# EasyEDA Pro project EPS32-v2.epro, board PCB2
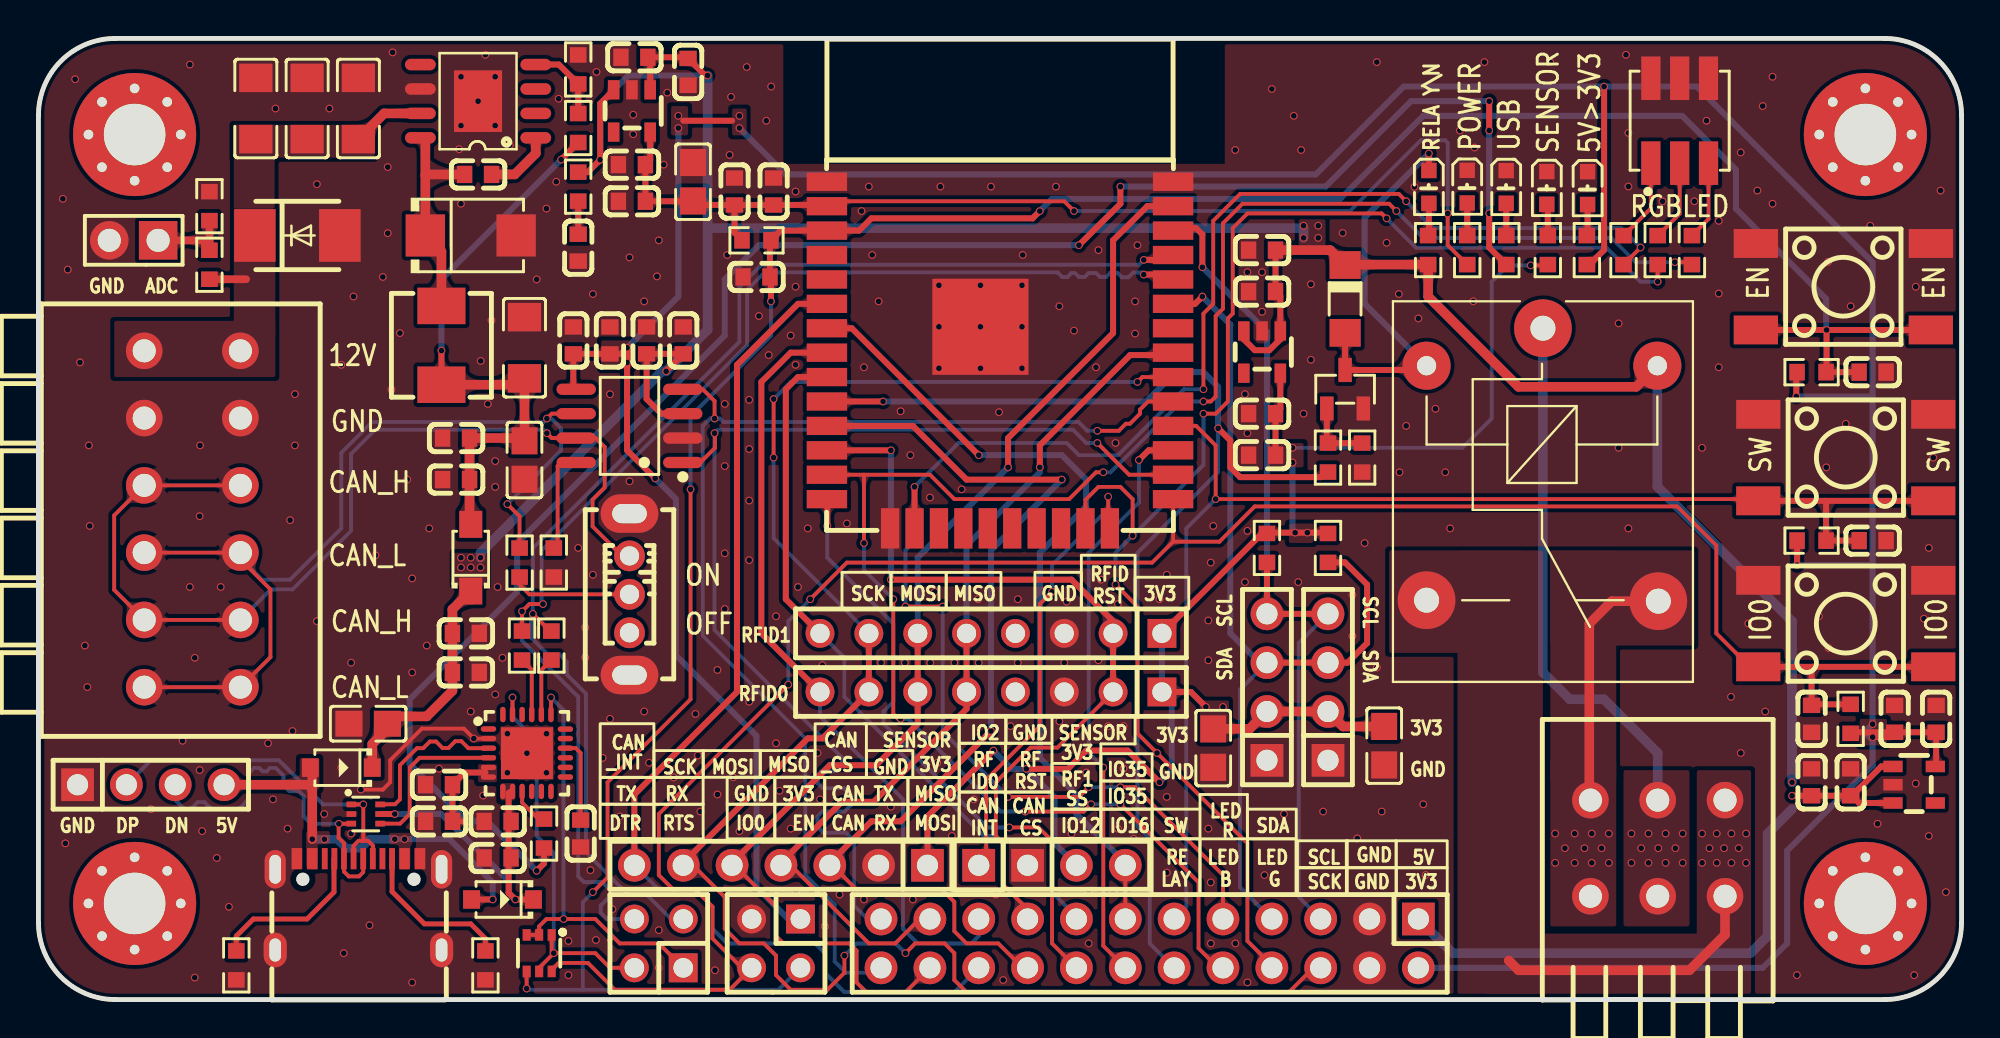
[diagram p1: board, top side]
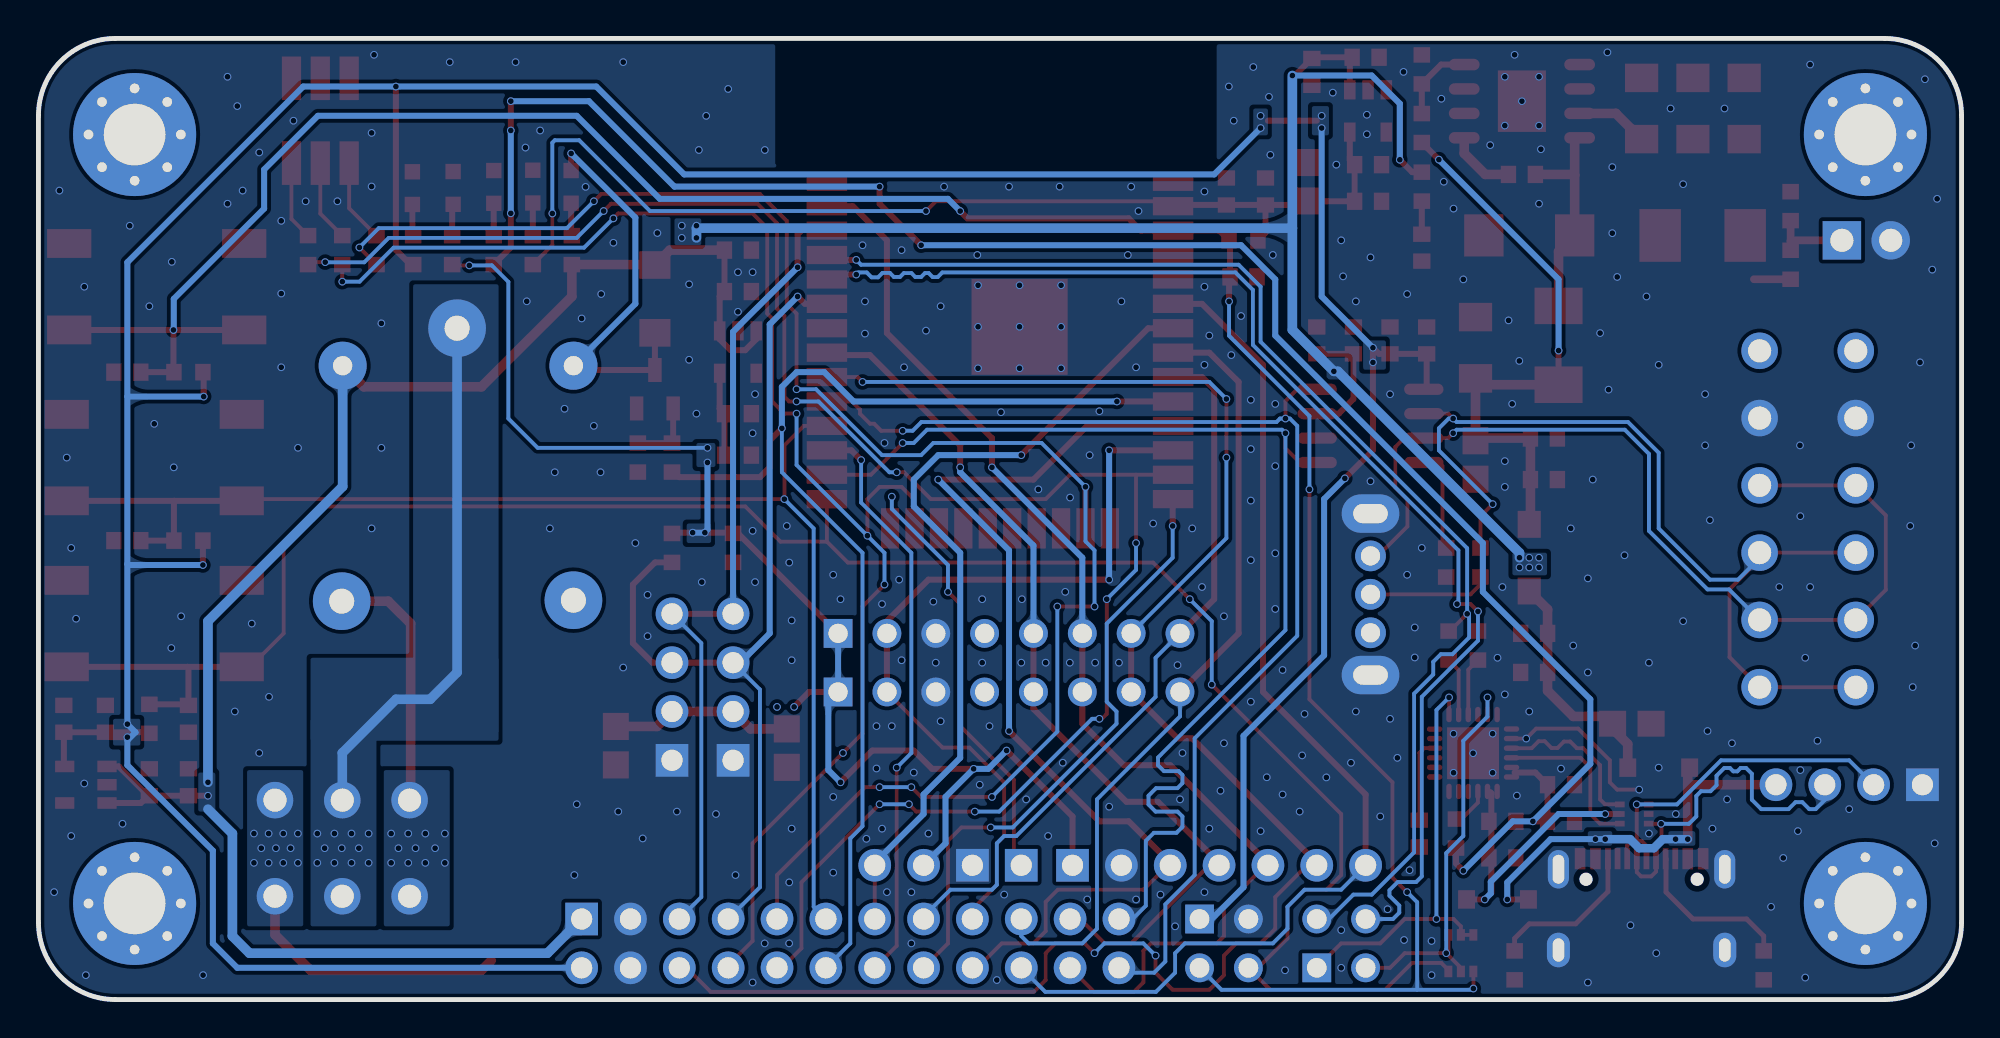
[diagram p2: board, bottom side, seen from below]

Outline 100 x 50 mm; copper layers: Top Layer, Bottom Layer. Coordinates in mm from the lower left corner of the outline.
Outline path: 0,46 0,4 arc(1.17,1.17) 4,0 96,0 arc(98.83,1.17) 100,4 100,46 arc(98.83,48.83) 96,50 4,50 arc(1.17,48.83) 0,46
Stack: Top Layer 0.035mm / Dielectric1 1.51mm FR4 er 4.5 / Bottom Layer 0.035mm

## Design rules (mm)
net $1N1005: DP2
net $1N1016: DP2
net CAN_RX: DP6
net CAN_TX: DP6
net RX: DP4
net TX: DP4
net CAN_H: DP5
net $1N8799: DP3
net $1N8801: DP3
net CAN_L: DP5
net DP: DP7
net DN: DP7
template: 自定义配置1
spacing copperThickness1oz (default): track to track 0.1, other pairs 0.1 to 0.3
spacing copperThickness2oz: track to track 0.203, other pairs 0.152 to 0.3
spacing copperThicknessInner0.5oz: track to track 0.089, other pairs 0.152 to 0.3
track width copperThickness1oz (default): min 0.1, default 0.2, max 10
track width copperThickness0.5oz: min 0.089, default 0.254, max 2.54
track width copperThickness2oz: min 0.203, default 0.254, max 2.54
differential pair differentialPair (default): width min 0.127, default 0.254, max 2.54; gap min 0.2, default 0.2
via viaSize (default): diameter min 0.4, default 0.4, max 10; hole min 0.3, default 0.3, max 6.3

## Placement (name value [footprint] x y rotation side)
C1  22uF  [C0805]  17.14 14.35 180 top
C2  10uF  [C0603]  22.22 17.02 0 top
C3  100nF  [C0603]  22.22 19.05 0 top
C6  4.7uF  [C0603]  28.19 8.64 90 top
C9  100nF  [C0603]  95.38 23.88 0 top
C10  100nF  [C0603]  95.38 32.64 0 top
C11  100nF  [C0603]  92.2 14.61 270 top
C351  10uF  [C0603]  92.2 11.3 270 top
C352  10uF  [C0603]  98.68 14.61 270 top
C353  100nF  [C0603]  94.23 11.3 270 top
C354  100nF  [C0603]  96.52 14.61 270 top
C355  10uF  [C0603]  33.53 34.29 270 top
C356  100nF  [C0603]  31.62 34.29 270 top
C357  10uF  [C0603]  29.72 34.29 270 top
C358  100nF  [C0603]  27.81 34.29 270 top
C359  100nF  [C0603]  20.83 9.27 0 top
C360  4.7uF  [C0603]  20.83 11.18 0 top
C361  10uF  [C0603]  23.88 7.37 0 top
C362  100nF  [C0603]  23.88 9.27 0 top
C363  22uF  [C0805]  69.98 13.21 270 top
C364  22uF  [C0805]  61.09 13.08 270 top
C369  10uF  [C0603]  63.63 38.99 0 top
C370  10uF  [C0603]  63.63 30.48 0 top
C371  100nF  [C0603]  63.63 36.83 0 top
C372  100nF  [C0603]  63.63 28.32 0 top
C373  10uF  [C0603]  30.86 43.43 0 top
C374  100nF  [C0603]  30.99 49.02 0 top
C375  100nF  [C0603]  30.86 41.53 0 top
C376  10uF  [C0603]  33.78 48.26 90 top
C377  22uF  [C0805]  34.04 42.55 90 top
C378  10uF  [C0603]  36.19 42.04 90 top
C379  100nF  [C0603]  38.23 42.04 90 top
C380  100nF  [C0603]  37.34 37.59 180 top
C382  10uF  [C1206]  13.97 46.36 270 top
C383  22uF  [C1206]  11.3 46.36 270 top
C384  100nF  [C1206]  16.64 46.36 270 top
C385  47uF  [C1206]  25.27 33.91 270 top
C386  22uF  [C0805]  25.27 28.07 90 top
C387  10uF  [C0603]  21.72 29.21 0 top
C388  100nF  [C0603]  21.72 27.05 0 top
C389  100nF  [C0603]  22.86 42.93 0 top
C390  4.7uF  [C0603]  28.07 39.12 90 top
CN1  New_Library_2601-1106  [CONN-TH_2601-1106]  8 25 270 top
D1  USBLC6-2P6  [SOT-666-6_L1.6-W1.2-P0.50-LS1.6-BL]  17.02 9.65 270 top
D2  5819W  [SOD-123_L2.7-W1.6-LS3.7-FD]  15.75 12.06 0 top
D3  LL4148-GS08  [SOD-80_L3.5-W1.5-RD]  67.94 36.45 270 top
D5  SS54SMB  [SMB_L4.6-W3.6-LS5.3-RD]  22.48 39.75 0 top
D6  SMBJ28A  [SMB_L4.6-W3.6-LS5.3-L-FD]  13.46 39.75 180 top
D7  DSK34  [SOD-123FL_L2.7-W1.8-LS3.8-RD]  22.48 22.99 90 top
D8  5819W  [SOD-123_L2.7-W1.6-LS3.7-FD]  24.13 5.21 0 top
H1  Hole_Pad  [MountingHole:MountingHole_3.2mm_M3_Pad_Via]  5 5 0 top
H2  Hole_Pad  [MountingHole:MountingHole_3.2mm_M3_Pad_Via]  5 45 0 top
H3  Hole_Pad  [MountingHole:MountingHole_3.2mm_M3_Pad_Via]  95 45 0 top
H4  Hole_Pad  [MountingHole:MountingHole_3.2mm_M3_Pad_Via]  95 5 0 top
H6  PZ254V-11-04P  [HDR-TH_4P-P2.54-V-M]  67.06 16.26 90 top
H7  PZ254V-11-04P  [HDR-TH_4P-P2.54-V-M]  63.88 16.26 90 top
H8  PZ254V-11-03P  [HDR-TH_3P-P2.54-V-M]  53.97 6.98 0 top
H9  PZ254V-11-08P  [HDR-TH_8P-P2.54-V-M]  49.53 16 180 top
H10  PZ254V-11-08P  [HDR-TH_8P-P2.54-V-M]  49.53 19.05 180 top
H11  HX PZ2.54-1x7P ZZ  [HDR-TH_7P-P2.54-V-M]  38.61 6.98 180 top
H12  HX PZ2.54-2x2P ZZ  [HDR-TH_HX-PZ2.54-2X2P-ZZ]  38.35 2.92 180 top
H13  HX PZ2.54-2x2P ZZ  [HDR-TH_HX-PZ2.54-2X2P-ZZ]  32.26 2.92 90 top
H14  PZ254V-12-24P  [HDR-TH_24P-P2.54-V-M-R2-C12-S2.54]  57.78 2.92 180 top
H15  PZ254V-11-01P  [HDR-TH_1P-P2.54-V-M]  48.9 6.98 0 top
H16  PZ254V-11-04P  [HDR-TH_4P-P2.54-V-M]  5.84 11.18 0 top
H17  PZ254V-11-02P  [HDR-TH_2P-P2.54-V-M]  4.95 39.5 180 top
K1  SANYOU_SRD_Form_C  [Relay_THT:Relay_SPDT_SANYOU_SRD_Series_Form_C]  78.23 34.92 270 top
L12  10uH  [IND-SMD_L5.4-W5.2_FXL0530]  20.95 34.04 270 top
LED1  TC5050RGBF08-3CJH-AF53A  [LED-SMD_6P-L5.0-W5.0-TL_TC5050RGBF08]  85.34 45.72 90 top
LED白  NCD0603W1  [LED0603-RD]  76.33 42.16 270 top
LED红  SZYY0603R  [LED0603-R-RD]  74.29 42.29 270 top
LED绿  XL-1608PGC-06  [LED0603-RD_GREEN]  78.49 42.16 270 top
LED蓝  SZYY0603B  [LED0603-R-RD_BLUE]  80.52 42.16 270 top
Q1  UMH3N  [SC-70-6_L2.2-W1.3-P0.65-LS2.1-BR]  26.03 2.41 90 top
Q2  BC817  [SOT-23-3_L2.9-W1.3-P1.90-LS2.4-BR]  67.94 31.75 270 top
R1  5.1kΩ  [R0603]  23.24 1.78 270 top
R2  5.1kΩ  [R0603]  10.29 1.78 270 top
R4  22Ω  [R0603]  25.15 18.42 90 top
R5  22Ω  [R0603]  26.67 18.42 90 top
R7  10kΩ  [R0603]  76.33 38.99 90 top
R8  10kΩ  [R0603]  92.2 23.88 180 top
R9  10kΩ  [R0603]  92.2 32.64 180 top
R10  10kΩ  [R0603]  94.23 14.61 270 top
R11  10kΩ  [R0603]  80.52 38.99 270 top
R12  1kΩ  [R0603]  82.42 38.99 90 top
R13  1kΩ  [R0603]  84.2 38.99 90 top
R14  1kΩ  [R0603]  85.98 38.99 90 top
R15  0Ω  [R0603]  26.8 22.73 270 top
R17  4.7kΩ  [R0603]  26.29 8.64 90 top
R18  10kΩ  [R0603]  72.26 38.99 90 top
R19  10kΩ  [R0603]  68.83 28.19 270 top
R20  1kΩ  [R0603]  67.06 28.19 90 top
R21  4.7kΩ  [R0603]  63.88 23.5 270 top
R22  4.7kΩ  [R0603]  67.06 23.5 270 top
R23  10kΩ  [R0603]  78.49 38.99 270 top
R24  10kΩ  [R0603]  74.29 38.99 270 top
R25  10kΩ  [R0603]  37.34 39.5 0 top
R30  120Ω  [R0603]  25.02 22.73 90 top
R31  82kΩ  [R0603]  8.89 38.23 90 top
R32  10kΩ  [R0603]  8.89 41.28 270 top
R34  100kΩ  [R0603]  28.07 45.34 90 top
R35  31.3kΩ  [R0603]  28.07 48.39 90 top
R36  470kΩ  [R0603]  28.07 42.29 90 top
SW1  KH-6X6X5H-STM  [SW-SMD_4P-L6.0-W6.0-P4.50-LS9.0_H5.0]  93.98 28.19 0 top
SW2  KH-6X6X5H-STM  [SW-SMD_4P-L6.0-W6.0-P4.50-LS9.0_H5.0]  93.85 37.08 0 top
SW3  KH-6X6X5H-STM  [SW-SMD_4P-L6.0-W6.0-P4.50-LS9.0_H5.0]  93.98 19.56 0 top
U31  ME6211C30M5G-N  [SOT-23-5_L2.9-W1.6-P0.95-LS2.8-BL]  97.54 11.18 270 top
U34  TJA1051T/3/1J  [SOIC-8_L4.9-W3.9-P1.27-LS6.0-BL]  30.73 29.84 90 top
U36  HX SS12D07VG5  [SW-TH_SS12D07VG3]  30.73 21.08 270 top
U37  CP2104-F03-GMR  [QFN-24_L4.0-W4.0-P0.50-BL-EP2.7]  25.4 12.83 270 top
U38  MHT192WDT-GOLD  [LED0603-RD-YELLOW]  72.26 42.16 270 top
U39  2601-1103  [CONN-TH_6P-P3.50_2601-1103]  84.2 7.87 0 top
U40  ME6211C30M5G-N  [SOT-23-5_L2.9-W1.6-P0.95-LS2.8-BL]  63.63 33.69 180 top
U41  ESP32-WROOM-32D-N4  [WIFIM-SMD_39P-L25.5-W18.0-P1.27-BL]  50 33.53 270 top
U42  ME6211C30M5G-N  [SOT-23-5_L2.9-W1.6-P0.95-LS2.8-BL]  30.86 46.23 180 top
U43  TPS5450MDDAREP  [POWERPAD-SO-8_L4.9-W3.9-P1.27-LS6.0-BL-EP]  22.86 46.74 90 top
USB1  TYPE-C 16PIN 2MD(073)  [USB-C-SMD_TYPE-C-6PIN-2MD-073]  16.64 4.95 0 top

## Footprints (pads in the part's own frame, mm; a bottom-side part is the same pattern mirrored in y, then rotated)
C0603
  rect 0.8x0.9 smd: 1(-0.7,0) 2(0.7,0)
C0805
  rect 1.41x1.35 smd: 1(-1,0) 2(1,0)
C1206
  rect 1.485x1.728 smd: 1(-1.593,0) 2(1.593,0)
CONN-TH_6P-P3.50_2601-1103
  round 1.9 hole 1.2: 1(-3.5,2.5) 2(-3.5,-2.5) 3(0,2.5) 4(0,-2.5) 5(3.5,2.5) 6(3.5,-2.5)
CONN-TH_2601-1106
  round 1.9 hole 1.2: 1(-8.75,2.5) 1(-8.75,-2.5) 2(-5.25,2.5) 2(-5.25,-2.5) 3(-1.75,2.5) 3(-1.75,-2.5) 4(1.75,2.5) 4(1.75,-2.5) 5(5.25,2.5) 5(5.25,-2.5) 6(8.75,2.5) 6(8.75,-2.5)
HDR-TH_1P-P2.54-V-M
  rect 1.7x1.7 hole 1.1: 1(0,0)
HDR-TH_2P-P2.54-V-M
  rect 2x2 hole 1.2: 1(-1.27,0)
  round 2 hole 1.2: 2(1.27,0)
HDR-TH_3P-P2.54-V-M
  rect 1.7x1.7 hole 1.1: 1(-2.54,0)
  round 1.7 hole 1.1: 2(0,0) 3(2.54,0)
HDR-TH_4P-P2.54-V-M
  rect 1.7x1.7 hole 1.1: 1(-3.81,0)
  round 1.7 hole 1.1: 2(-1.27,0) 3(1.27,0) 4(3.81,0)
HDR-TH_7P-P2.54-V-M
  rect 1.7x1.7 hole 1.1: 1(-7.62,0)
  round 1.7 hole 1.1: 2(-5.08,0) 3(-2.54,0) 4(0,0) 5(2.54,0) 6(5.08,0) 7(7.62,0)
HDR-TH_8P-P2.54-V-M
  rect 1.5x1.5 hole 1: 1(-8.89,0)
  round 1.5 hole 1: 2(-6.35,0) 3(-3.81,0) 4(-1.27,0) 5(1.27,0) 6(3.81,0) 7(6.35,0) 8(8.89,0)
HDR-TH_24P-P2.54-V-M-R2-C12-S2.54
  rect 1.7x1.7 hole 1.1: 1(-13.97,-1.27)
  round 1.7 hole 1.1: 2(-13.97,1.27) 3(-11.43,-1.27) 4(-11.43,1.27) 5(-8.89,-1.27) 6(-8.89,1.27) 7(-6.35,-1.27) 8(-6.35,1.27) 9(-3.81,-1.27) 10(-3.81,1.27) 11(-1.27,-1.27) 12(-1.27,1.27) 13(1.27,-1.27) 14(1.27,1.27) 15(3.81,-1.27) 16(3.81,1.27) 17(6.35,-1.27) 18(6.35,1.27) 19(8.89,-1.27) 20(8.89,1.27) 21(11.43,-1.27) 22(11.43,1.27) 23(13.97,-1.27) 24(13.97,1.27)
HDR-TH_HX-PZ2.54-2X2P-ZZ
  rect 1.5x1.5 hole 1.02: 1(-1.27,-1.27)
  round 1.5 hole 1.02: 2(-1.27,1.27) 3(1.27,-1.27) 4(1.27,1.27)
IND-SMD_L5.4-W5.2_FXL0530
  rect 1.9x2.5 smd: 1(-2.05,0) 2(2.05,0)
LED0603-R-RD
  rect 0.8x0.8 smd: 1(0.851,0) 2(-0.851,0)
LED0603-R-RD_BLUE
  rect 0.8x0.8 smd: 1(0.8,0.038) 2(-0.901,0.038)
LED0603-RD
  rect 0.8x0.8 smd: 1(-0.963,-0.005) 2(0.739,-0.005)
LED0603-RD-YELLOW
  rect 0.8x0.8 smd: 1(-0.965,0.038) 2(0.737,0.038)
LED0603-RD_GREEN
  rect 0.8x0.8 smd: 1(-0.911,-0.05) 2(0.791,-0.05)
LED-SMD_6P-L5.0-W5.0-TL_TC5050RGBF08
  rect 2.265x1 smd: 1(-2.208,1.5) 2(-2.208,0) 3(-2.208,-1.5) 4(2.208,-1.5) 5(2.208,0) 6(2.208,1.5)
MountingHole:MountingHole_3.2mm_M3_Pad_Via
  round 0.8 hole 0.5: 1(-2.4,0) 1(-1.697,1.697) 1(-1.697,-1.697) 1(0,2.4) 1(0,-2.4) 1(1.697,1.697) 1(1.697,-1.697) 1(2.4,0)
  round 6.4 hole 3.2: 1(0,0)
POWERPAD-SO-8_L4.9-W3.9-P1.27-LS6.0-BL-EP
  oval 0.6x1.6 smd: 1(-1.905,-3) 2(-0.635,-3) 3(0.635,-3) 4(1.905,-3) 5(1.905,3) 6(0.635,3) 7(-0.635,3) 8(-1.905,3)
  rect 3.2x2.5 smd: 9(0,0)
QFN-24_L4.0-W4.0-P0.50-BL-EP2.7
  oval 0.28x0.8 smd: 1(-1.25,-2) 2(-0.75,-2) 3(-0.25,-2) 4(0.25,-2) 5(0.75,-2) 6(1.25,-2) 13(1.25,2) 14(0.75,2) 15(0.25,2) 16(-0.25,2) 17(-0.75,2) 18(-1.242,2)
  oval 0.8x0.28 smd: 7(2,-1.25) 8(2,-0.75) 9(2,-0.25) 10(2,0.25) 11(2,0.75) 12(2,1.25) 19(-2,1.25) 20(-2,0.75) 21(-2,0.25) 22(-2,-0.25) 23(-2,-0.75) 24(-2,-1.25)
  rect 2.7x2.7 smd: 25(0.013,0)
R0603
  rect 0.806x0.864 smd: 1(-0.753,0) 2(0.753,0)
Relay_THT:Relay_SPDT_SANYOU_SRD_Series_Form_C
  round 3 hole 1.3: 1(0,0) 3(14.15,-6.05) 4(14.2,6)
  round 2.5 hole 1: 2(1.95,-6.05) 5(1.95,5.95)
SC-70-6_L2.2-W1.3-P0.65-LS2.1-BR
  rect 0.6x0.42 smd: 1(0.95,-0.65) 2(0.95,0) 3(0.95,0.65) 4(-0.95,0.65) 5(-0.95,0) 6(-0.95,-0.65)
SMB_L4.6-W3.6-LS5.3-L-FD
  rect 2.159x2.743 smd: 1(-2.21,0) 2(2.21,0)
SMB_L4.6-W3.6-LS5.3-RD
  rect 2.047x2.192 smd: 1(-2.361,0) 2(2.361,0)
SOD-80_L3.5-W1.5-RD
  rect 1.44x1.62 smd: 1(-1.765,0) 2(1.765,0)
SOD-123_L2.7-W1.6-LS3.7-FD
  rect 0.88x0.96 smd: 1(-1.61,0) 2(1.61,0)
SOD-123FL_L2.7-W1.8-LS3.8-RD
  rect 1.4x1.2 smd: 1(-1.735,0) 2(1.735,0)
SOIC-8_L4.9-W3.9-P1.27-LS6.0-BL
  oval 0.588x2.045 smd: 1(-1.905,-2.772) 2(-0.635,-2.772) 3(0.635,-2.772) 4(1.905,-2.772) 5(1.905,2.772) 6(0.635,2.772) 7(-0.635,2.772) 8(-1.905,2.772)
SOT-23-3_L2.9-W1.3-P1.90-LS2.4-BR
  rect 1.25x0.7 smd: 1(1,-0.95) 2(1,0.95) 3(-1,0)
SOT-23-5_L2.9-W1.6-P0.95-LS2.8-BL
  rect 0.6x1 smd: 1(-0.95,-1.1) 2(0,-1.1) 3(0.95,-1.1) 4(0.95,1.1) 5(-0.95,1.1)
SOT-666-6_L1.6-W1.2-P0.50-LS1.6-BL
  rect 0.3x0.5 smd: 1(-0.5,-0.75) 2(0,-0.75) 3(0.5,-0.75) 4(0.5,0.75) 5(0,0.75) 6(-0.5,0.75)
SW-SMD_4P-L6.0-W6.0-P4.50-LS9.0_H5.0
  rect 2.3x1.5 smd: 1(-4.55,2.25) 2(4.55,2.25) 3(-4.55,-2.25) 4(4.55,-2.25)
SW-TH_SS12D07VG3
  oval 1.6x1.6 hole 1: 1(-2,0) 2(0,0) 3(2,0)
  oval 2x3 hole 1x1.8: 4(4.2,0) 5(-4.2,0)
USB-C-SMD_TYPE-C-6PIN-2MD-073
  rect 0.55x1.1 smd: 1(-3.2,2.375) 2(-2.4,2.375) 11(2.4,2.375) 12(3.2,2.375)
  rect 0.3x1.1 smd: 3(-1.75,2.375) 4(-1.25,2.375) 5(-0.75,2.375) 6(-0.25,2.375) 7(0.25,2.375) 8(0.75,2.375) 9(1.25,2.375) 10(1.75,2.375)
  oval 1.1x2 hole 0.6x1.5: 13(-4.325,1.825) 14(4.325,1.825)
  oval 1.2x1.8 hole 0.6x1.2: 13(-4.325,-2.375) 14(4.325,-2.375)
WIFIM-SMD_39P-L25.5-W18.0-P1.27-BL
  rect 0.95x2.1 smd: 1(-9.015,-9) 2(-7.745,-9) 3(-6.475,-9) 4(-5.205,-9) 5(-3.935,-9) 6(-2.665,-9) 7(-1.395,-9) 8(-0.125,-9) 9(1.145,-9) 10(2.415,-9) 11(3.685,-9) 12(4.955,-9) 13(6.225,-9) 14(7.495,-9) 25(7.495,9) 26(6.225,9) 27(4.955,9) 28(3.685,9) 29(2.415,9) 30(1.145,9) 31(-0.125,9) 32(-1.395,9) 33(-2.665,9) 34(-3.935,9) 35(-5.205,9) 36(-6.475,9) 37(-7.745,9) 38(-9.015,9)
  rect 2.1x0.95 smd: 15(9.015,-5.715) 16(9.015,-4.445) 17(9.015,-3.175) 18(9.015,-1.905) 19(9.015,-0.635) 20(9.015,0.635) 21(9.015,1.905) 22(9.015,3.175) 23(9.015,4.445) 24(9.015,5.715)
  rect 5x5 smd: 39(-1.472,-1.017)

## Nets
As in the schematic.

Pads without a net: H1 1; H2 1; H3 1; H4 1; H9 4; H10 4; U31 4; U36 3; U37 1 10 11 12 13 14 15 17 18 22 24; U40 4; U41 4 5 17 18 19 20 21 22 32; U42 4; U43 2 3 5; USB1 3 9

## Via types
v1: diameter 0.4, hole 0.3, Top Layer to Bottom Layer, 480 vias

## Routing (per net, layer and track width the routed paths; a pad name or vN(x,y) marks a point on that pad's centre or on a via; arc(x,y) is an arc through that point)
3V3: length 204.4
  Top Layer w0.312: R11.2 80.65,38.24 81.41,39 v1(81.41,47.5) ; R9.2 91.41,32.6 v1(91.41,31.37) ; v1(95.38,13.65) 96.27,13.65 C354.2 ; C354.2 C352.2 98.68,12.17 U31.5 ; C354.2 94.29,13.91 R10.2 ; R8.2 v1(91.45,22.61) ; 33.53,45.72 36.07,45.72 ; v1(32.07,27.11) 30.61,28.58 v1(30.61,33.15) v1(30.61,33.91) 30.29,33.59 C357.2 C358.2 27.81,31.9 U34.5
  Bottom Layer w0.312: H14.2 89.66,1.65 90.93,2.92 90.93,7.75 95.38,12.19 95.38,13.48 94.95,13.91 v1(95.38,14.33) 95.38,22.65 ; v1(91.41,31.37) 95.38,31.37 ; 95.38,31.37 95.38,22.65 ; 95.38,31.37 95.38,38.35 86.23,47.5 v1(81.41,47.5) 70.99,47.5 66.42,42.93 38.86,42.93 v1(36.45,45.34) ; v1(33.27,45.34) 33.27,36.58 v1(30.61,33.91) ; 95.38,22.65 95.33,22.61 v1(91.45,22.61) ; H12.1 38.99,4.19 37.34,5.84 37.34,13.72 33.15,17.91 33.15,26.03 v1(32.07,27.11)
  vias: v1(33.27,45.97) v1(36.45,45.97)
3V3_POWER: length 56.2
  Top Layer w0.2: v1(73.28,40.89) 73.28,39.25 R24.2 ; 41,41.27 41.26,41.53 53.34,41.53 v1(53.85,41.02)
  Top Layer w0.312: C378.1 34.24,41.34 C377.1 34.02,41.53 C375.2 C373.2 31.81,43.68 31.81,45.13 ; C378.1 C379.1 40.94,41.34 41,41.27 ; C378.1 36.19,39.89 R25.1
  Bottom Layer w0.2: v1(73.28,40.89) 73.28,44.58 73.15,44.7 71.88,44.7 68.2,41.02 v1(53.85,41.02)
+5V: length 192.2
  Top Layer w0.312: 94.3,10.6 94.68,10.23 U31.3 ; 94.3,10.6 95.82,12.13 U31.1 ; 94.3,10.6 C353.2 C351.2 v1(91.19,10.6) ; 62.68,34.78 62.68,34.35 63.25,33.78 64.01,33.78 64.58,34.35 U40.1 64.58,36.58 C371.2 C369.2 ; 31.81,47.33 31.81,48.9 C374.2 33.72,49.02 C376.2 34.67,48.07 v1(34.8,48.07) ; v1(32.64,32.68) 32.64,32.7 C355.2 C356.2 31.62,31.24 32.38,30.48 U34.3 ; U42.3 29.91,47.31 29.21,46.61 v1(29.21,43.69) 28.57,43.04 R36.2
  Top Layer w0.5: D2.2 17.36,13.29 18.14,14.08 C1.1 18.53,14.73 20.19,14.73 21.53,16.06 C2.1 C3.1 21.53,20.3 D7.1 ; K1.5 83.08,31.88 76.96,31.88 72.26,36.58 R18.1 67.97,38.24 D3.1 67.17,38.99 C369.2
  Bottom Layer w0.312: v1(29.21,43.69) 29.21,46.61 30.67,48.07 v1(34.8,48.07)
  Bottom Layer w0.5: v1(34.8,48.07) 34.8,40.13 ; 34.8,40.13 34.8,34.84 v1(32.64,32.68) 32.43,32.68 22.99,23.24 v1(22.99,22.99) ; 34.8,40.13 65.79,40.13 v1(65.79,39.62) ; v1(91.19,11.3) 91.19,19.69 84.18,26.69 K1.5 ; H14.1 73.53,2.41 89.03,2.41 89.92,3.3 89.92,8.64 91.19,9.91
  vias: v1(21.97,22.99) v1(21.97,22.48) v1(22.48,22.99) v1(22.48,22.48) v1(22.99,22.48) v1(65.79,40.26) v1(66.55,40.26) v1(66.55,39.62)
GND: length 8.8
  Top Layer w0.2: v1(16.76,10.92) 17.91,10.92 18.29,11.3 18.29,12.45 19.94,14.1 22.12,14.1 v1(22.64,13.58) U37.2
  vias: v1(1.27,41.66) v1(1.4,8.13) v1(1.52,37.97) v1(1.91,47.88) v1(2.16,33.15) v1(2.41,18.42) v1(2.54,16.26) v1(2.62,28.83) v1(2.67,24.64) v1(5.84,9.91) v1(7.49,13.46) v1(7.87,48.64) v1(7.87,21.46) v1(8.13,17.78) v1(8.13,1.14) v1(8.4,28.83) v1(8.38,25.15) v1(8.38,11.94) v1(8.51,8.76) v1(9.27,7.37) v1(9.48,21.46) v1(9.91,4.83) v1(11.94,13.33) v1(12.19,10.41) v1(12.33,46.36) v1(12.95,8.89) v1(13.08,24.94) v1(13.21,13.97) v1(13.33,31.5) v1(13.33,28.83) v1(14.48,42.42) v1(14.48,19.69) v1(14.86,9.65) v1(15.13,46.36) v1(15.75,33.02) v1(15.75,12.06) v1(15.88,2.41) v1(16.26,17.53) v1(16.26,8.64) v1(16.38,36.58) v1(17.22,3.87) v1(17.53,23.11) v1(17.91,37.59) v1(18.16,43.31) v1(18.16,39.87) v1(18.42,49.28) v1(18.36,31.73) v1(18.8,34.67) v1(19.18,27.05) v1(19.43,21.91) v1(19.43,17.02) v1(19.43,0.89) v1(20.19,18.42) v1(20.32,24.51) v1(20.83,12.01) v1(21.87,44.24) v1(21.97,48.01) v1(21.97,45.47) v1(21.97,41.4) v1(22.48,14.99) v1(22.86,46.74) v1(23,33.22) v1(23.12,10.61) v1(23.24,49.15) v1(23.37,30.99) v1(23.56,35.33) v1(23.75,48.01) v1(23.75,45.47) v1(23.75,28.01) v1(23.75,26.67) v1(23.75,15.88) v1(23.88,21.46) v1(24.13,17.78) v1(24.38,13.83) v1(24.38,11.8) v1(24.51,44.45) v1(25.4,12.81) v1(25.91,37.47) v1(26.42,41.15) v1(26.42,13.83) v1(26.42,11.8) v1(26.92,42.55) v1(27.05,46.86) v1(27.56,3.05) v1(27.56,1.27) v1(28.07,23.5) v1(28.43,19.36) v1(28.43,17.8) v1(28.7,6.73) v1(28.83,36.7) v1(28.83,22.1) v1(29.02,48.26) v1(28.99,3.1) v1(29.34,12.57) v1(29.72,31.49) v1(29.72,14.61) v1(29.84,4.7) v1(30.23,9.53) v1(30.73,38.61) v1(30.73,26.96) v1(30.92,46.03) v1(30.92,45.02) v1(31.5,36.32) v1(31.5,14.99) v1(31.75,12.32) v1(32.16,37.62) v1(32.26,39.5) v1(32.26,3.61) v1(32.26,1.65) v1(32.51,43.43) v1(32.7,47.18) v1(33.03,11.56) v1(34.16,14.86) v1(34.29,12.7) v1(34.42,9.78) v1(35.18,1.52) v1(35.31,17.14) v1(35.31,10.67) v1(35.69,30.99) v1(35.69,27.75) v1(35.69,23.22) v1(35.69,20.32) v1(35.81,38.73) v1(35.94,43.94) v1(36.01,46.96) v1(36.13,11.56) v1(36.45,8.76) v1(36.83,48.51) v1(36.96,31.2) v1(36.96,28.64) v1(36.96,25.96) v1(36.96,22.86) v1(36.96,15.49) v1(37.47,35.56) v1(37.85,45.72) v1(37.97,33.53) v1(38.1,47.5) v1(38.35,19.94) v1(38.35,13.33) v1(38.53,10.86) v1(39.12,34.54) v1(39.12,8.89) v1(39.37,42.04) v1(39.37,37.08) v1(39.37,33.02) v1(39.37,5.59) v1(39.5,21.46) v1(40,24.51) v1(40.51,12.83) v1(40.64,10.41) v1(40.77,17.4) v1(40.89,3.81) v1(41.66,5.46) v1(42.04,24.77) v1(42.8,41.02) v1(42.93,32.89) v1(42.92,5.21) v1(43.18,42.29) v1(43.35,38.73) v1(43.69,36.32) v1(43.81,17.53) v1(44.32,10.03) v1(44.83,30.61) v1(45.05,17.53) v1(45.34,28.32) v1(45.47,5.21) v1(46.36,26.12) v1(46.37,17.53) v1(46.61,21.21) v1(46.74,12.32) v1(46.82,37.16) v1(46.82,35) v1(46.82,32.84) v1(46.9,42.29) v1(47.5,8.51) v1(47.62,17.53) v1(48.01,26.54) v1(48.64,10.41) v1(48.86,20.83) v1(48.9,17.53) v1(48.98,37.16) v1(48.98,35) v1(48.98,32.84) v1(49.53,42.29) v1(49.78,5.46) v1(49.95,30.55) v1(50.16,1.02) v1(50.55,14.22) v1(50.93,20.83) v1(50.93,17.53) v1(51.14,37.16) v1(51.14,35) v1(51.14,32.84) v1(51.05,11.18) v1(51.18,38.73) v1(52.91,42.29) v1(53.09,36.07) v1(53.09,14.48) v1(53.34,17.53) v1(53.47,20.7) v1(53.72,8.64) v1(53.85,34.8) v1(54.48,11.81) v1(54.61,5.59) v1(54.61,2.92) v1(54.99,32.89) v1(55.12,38.99) v1(55.12,17.65) v1(55.25,21.84) v1(55.63,14.22) v1(55.88,5.59) v1(56.01,28.96) v1(56.13,20.57) v1(56.13,8.89) v1(56.42,14.22) v1(56.42,12.02) v1(56.95,8.36) v1(57.02,36.32) v1(57.02,34.65) v1(57.15,39.24) v1(58.29,20.83) v1(58.67,22.1) v1(58.67,10.54) v1(58.67,6.6) v1(60.83,19.72) v1(60.83,17.65) v1(60.83,8.89) v1(60.96,22.73) v1(60.96,6.1) v1(60.97,2.92) v1(61.09,24.64) v1(62.23,44.2) v1(62.24,2.92) v1(62.74,31.5) v1(62.74,21.72) v1(62.87,37.84) v1(62.87,29.46) v1(62.87,24.38) v1(62.87,0.89) v1(63.63,37.84) v1(63.63,35.78) v1(63.75,6.48) v1(64.13,47.37) v1(64.77,9.65) v1(65.28,45.97) v1(65.51,21.72) v1(65.66,44.2) v1(65.79,30.48) v1(66.17,37.21) v1(66.17,33.28) v1(66.8,9.78) v1(67.82,39.88) v1(68.33,21.05) v1(68.33,18.91) v1(68.58,8.38) v1(68.96,23.75) v1(69.59,48.77) v1(69.6,17.27) v1(69.85,9.78) v1(70.1,39.37) v1(70.74,36.7) v1(70.77,27.43) v1(71.12,29.84) v1(71.55,42.28) v1(71.75,35.43) v1(72.01,10.16) v1(72.13,6.48) v1(72.64,30.73) v1(73.15,27.43) v1(73.41,24.51) v1(73.91,45.21) v1(74.61,36.33) v1(74.68,44.32) v1(75.19,48.77) v1(78.61,48.77) v1(82.17,35.18) v1(82.17,28.7) v1(82.55,49.15) v1(82.68,45.08) v1(82.68,42.3) v1(82.68,24.51) v1(84.46,41.53) v1(86.11,41.53) v1(86.5,28.7) v1(86.74,45.72) v1(87.38,40.51) v1(87.38,36.73) v1(87.38,32.89) v1(88.01,15.75) v1(88.52,44.07) v1(88.52,12.83) v1(88.91,19.56) v1(89.38,42.09) v1(89.66,46.48) v1(89.79,14.99) v1(90.17,48.01) v1(90.17,41.4) v1(91.44,1.27) v1(92.58,19.94) v1(92.96,27.69) v1(93.07,38.38) v1(93.09,18.29) v1(93.98,29.95) v1(94.23,36.07) v1(95.25,40.26) v1(95.63,9.14) v1(97.54,1.27) v1(97.62,37.08) v1(97.62,11.24) v1(98.04,19.81) v1(98.3,23.5) v1(98.3,8.51) v1(98.53,28.19) v1(98.91,42.09) v1(99.19,5.59)
VCC: length 5.7
  Top Layer w0.4: R31.1 10.8,37.47
  Top Layer w0.5: U43.7 17.98,46.1 C384.2
VDD: length 99.9
  Top Layer w0.312: v1(56.26,42.29) 56.26,41.4 v1(54.1,39.24) ; v1(25.91,6.7) 26.29,7.08 R17.1 ; 23.24,11.81 22.16,11.81 C360.2 C359.2 v1(22.29,9.27) ; R7.1 75.44,39.12 v1(75.44,40.9) ; v1(75.44,46.74) v1(75.44,45.21)
  Bottom Layer w0.312: v1(56.26,42.29) 66.93,42.29 71.37,46.74 v1(75.44,46.74) ; v1(54.1,39.24) 37.47,39.24 35.69,37.47 35.69,34.54 24.89,23.75 24.89,21.21 19.3,15.62 19.3,12.26 v1(22.29,9.27) 23.33,9.27 v1(25.91,6.7) ; v1(75.44,45.21) v1(75.44,40.9)
3.3_SENSOR: length 84.9
  Top Layer w0.2: v1(77.6,38.19) 78.44,38.19 R23.2
  Top Layer w0.312: R22.1 67.01,24.29 v1(65.98,24.29) v1(65.35,24.29) 63.92,24.29 R21.1 63.62,24.25 H10.1 ; H11.1 46.23,9.53 v1(49.66,12.95) ; v1(51.37,12) 53.53,12 54.48,12.95 56.64,12.95 v1(58.29,11.3) ; v1(60.71,15.22) 59.93,16 H9.1 ; C372.2 C370.2 64.58,30.73 64.58,32.58
  Top Layer w0.5: C363.1 67.83,14.21 H6.2 H7.2 62.98,14.08 C364.1
  Bottom Layer w0.2: v1(77.6,38.19) 76.42,38.19 75.56,37.34 75.56,30.23 74.04,28.7 v1(65.21,28.7)
  Bottom Layer w0.312: v1(49.66,12.95) 50.61,12 v1(51.37,12) 52.83,10.54 52.83,8.13 H8.2 ; H10.1 H9.1 58.93,15.49 58.93,11.94 v1(58.29,11.3) ; v1(65.98,24.29) 65.37,24.29 65.21,24.45 v1(65.21,27.94)
  vias: v1(61.59,15.22)
ADC: length 4.2
  Top Layer w0.4: R31.2 8.89,39.46 ; 8.89,39.46 R32.2 ; 8.89,39.46 8.85,39.5 H17.1
AUX_CAN_CS: length 52.6
  Top Layer w0.2: 41.15,7.11 42.54,5.72 46.99,5.72 47.62,5.08 47.62,3.56 48.26,2.92 49.91,2.92 51.18,1.65 H14.18
  Top Layer w0.312: v1(53.21,27.05) 48.26,27.05 45.47,29.84 U41.11 ; 41.15,7.11 43.31,9.27 44.83,9.27 v1(49.53,13.97)
  Bottom Layer w0.312: v1(49.53,13.97) 49.53,23.37 v1(53.21,27.05)
AUX_CAN_INT: length 56.5
  Top Layer w0.312: 30.99,7.11 30.99,10.67 36.32,16 36.32,33.02 39.5,36.19 41,36.19
  Bottom Layer w0.2: 48.9,1.65 47.64,0.4 41.89,0.4 40.89,1.4 40.89,2.41 40.39,2.92 35.81,2.92 35.05,3.68 35.05,4.83 34.16,5.72 32.26,5.72 H11.7
CAN_H: length 51
  Top Layer w0.2: U36.1 30.34,23.08 28.81,24.61 28.81,26.01 29.44,26.63 29.44,28.75 28.98,29.21 U34.7 26.69,29.21 v1(26.44,29.46) ; CN1.3 CN1.3 3.94,25.19 3.94,21.31 CN1.5 CN1.5
  Bottom Layer w0.2: v1(26.44,29.46) 26.26,29.64 17.51,29.64 16.26,28.39 16.26,24.38 13.21,21.34 12.09,21.34 CN1.5
CAN_L: length 51
  Top Layer w0.2: v1(24.38,25.77) 25.02,25.14 25.02,23.49 ; U34.6 26.69,30.48 v1(26.44,30.23) ; CN1.4 CN1.4 10.5,22.9 12.06,21.34 12.06,17.81 CN1.6 CN1.6
  Bottom Layer w0.2: CN1.4 10.5,22.97 11.62,21.84 13.08,21.84 15.75,24.51 15.75,28.45 17.34,30.05 26.26,30.05 v1(26.44,30.23) 26.67,30.23 27.18,29.72 27.18,28.57 v1(24.38,25.77)
CAN_RX: length 61.9
  Top Layer w0.2: v1(35.16,30.23) 35.16,31.14 34.54,31.75 U34.4 ; v1(55.06,29.59) 56.18,29.59 56.55,29.96 56.76,29.96 57.28,30.48 57.28,30.69 57.7,31.11 U41.29
  Bottom Layer w0.2: v1(55.06,29.59) 55.06,29.59 54.54,29.59 54.09,30.05 35.62,30.05 35.44,30.23 v1(35.16,30.23) 34.93,30.23 34.54,29.84 34.54,18.92 39.88,13.59 39.88,6.48 41.4,4.95 41.4,1.98 41.99,1.4 43.56,1.4 H14.24
CAN_TX: length 61.9
  Top Layer w0.2: v1(55.06,28.95) 56.71,27.3 U41.26 ; U34.1 34.42,27.94 35.18,28.7 35.18,29.44 v1(35.16,29.46)
  Bottom Layer w0.2: H14.23 43.11,4.19 42.42,4.88 42.42,8.25 42,8.67 40.82,8.67 40.51,8.98 40.51,9.53 40.77,9.78 41.91,9.78 42.28,10.15 42.28,10.6 41.88,11 40.77,11 40.51,11.26 40.51,11.68 40.71,11.88 41.47,11.88 41.78,12.19 41.78,12.59 35.16,19.22 v1(35.16,29.46) 35.34,29.64 53.79,29.64 54.49,28.95 v1(55.06,28.95)
CP210-5V: length 15.9
  Top Layer w0.312: 24.51,10.8 24.45,10.73 24.45,5.55 v1(24.79,5.21) D8.2 ; D1.5 v1(18.53,9.65)
  Bottom Layer w0.312: v1(24.79,5.21) 24.48,5.52 24.48,6.13 20.95,9.65 v1(18.53,9.65)
DN: length 18.9
  Top Layer w0.2: USB1.7 16.89,6.63 16.66,6.41 16.14,6.41 15.89,6.66 USB1.5 15.89,8.14 15.61,8.42 15.61,9.13 v1(15.62,9.14) 16.26,9.14 D1.3
  Bottom Layer w0.2: H16.3 7.11,10.38 7.59,9.91 7.92,9.91 8.28,10.27 8.63,10.27 9,9.91 10.41,9.91 10.9,10.39 10.9,11.75 11.2,12.05 11.49,12.05 11.66,11.87 11.87,11.87 12.04,12.05 12.34,12.05 12.74,11.64 12.74,11.15 13.05,10.84 13.55,10.84 13.79,10.59 13.79,9.53 14.17,9.14 v1(15.62,9.14)
DP: length 18.9
  Top Layer w0.2: D1.1 v1(16.89,10.15) 16.89,8.26 16.89,8.25 ; USB1.6 16.39,8 16.64,8.25 16.89,8.25 ; 16.89,8.25 17.14,8.25 17.4,8 17.4,7.34 USB1.8
  Bottom Layer w0.2: H16.2 5.84,12.45 12.5,12.45 14.8,10.15 v1(16.89,10.15)
DTR: length 21.9
  Top Layer w0.2: v1(26.8,2.41) 28.96,2.41 29.72,1.65 H13.2 ; v1(26.8,2.41) 26.69,2.41 Q1.1 ; v1(26.8,2.41) 26.03,1.65 Q1.5 ; U37.23 v1(24.65,15.72)
  Bottom Layer w0.2: v1(26.8,2.41) 26.8,7.62 25.91,8.51 25.91,13.46 24.65,14.72 v1(24.65,15.72)
EN: length 136.1
  Top Layer w0.2: v1(28.83,5.59) 29.59,6.35 29.59,11.3 33.91,15.62 v1(33.91,26.54) ; Q1.4 v1(25.39,0.57)
  Top Layer w0.312: v1(38.09,36.32) 38.09,37.54 C380.1 38.04,39.44 R25.2 38.6,40 U41.3 42.67,40 43.31,40.64 51.69,40.64 v1(52.07,41.02) ; v1(92.98,34.83) 92.98,32.67 R9.1 94.68,32.64 ; v1(92.98,34.83) SW2.3 ; v1(92.98,34.83) SW2.4
  Bottom Layer w0.2: v1(25.39,0.57) 25.45,0.51 28.31,0.51 ; v1(38.09,36.32) 38.09,34.53 33.91,30.35 v1(33.91,26.54) ; 28.31,0.51 38.48,0.51 H12.2 ; 28.31,0.51 28.31,5.07 v1(28.83,5.59)
  Bottom Layer w0.312: v1(52.07,41.02) 52.71,41.66 67.69,41.66 72.01,45.97 85.47,45.97 88.26,43.18 88.26,41.15 92.96,36.45 92.96,34.8
FB: length 4.2
  Top Layer w0.312: U43.4 27.06,48.64 R35.1 R34.2
IO0: length 109.9
  Top Layer w0.2: 59,23.82 U41.25 ; 59,23.82 61.41,23.82 63.25,25.65 85.22,25.65 87.25,23.62 87.25,19.05 88.99,17.31 SW3.3 ; 59,23.82 57.91,22.73 42.04,22.73 v1(40.13,20.83) ; v1(38.99,16.38) 32.26,9.65 32.26,6.48 33.02,5.72 34.16,5.72 35.05,4.83 35.05,3.17 36.58,1.65 H12.4 35.94,0.51 29.97,0.51 28.57,1.91 27.05,1.91 26.69,1.54 Q1.6
  Top Layer w0.312: R10.1 92.26,15.36 C11.1 92.2,17.26 92.25,17.31 ; 92.25,17.31 SW3.4 ; 92.25,17.31 SW3.3
  Bottom Layer w0.2: v1(40.13,20.83) 38.99,19.69 v1(38.99,16.38)
IO2: length 23.7
  Top Layer w0.2: v1(52.71,21.21) 52.07,20.57 52.07,14.22 49.28,11.43 49.28,7.37 H15.1 ; U41.24 55.63,24.6 v1(55.63,26.16)
  Bottom Layer w0.2: v1(52.71,21.21) 52.71,22.61 55.63,25.53 v1(55.63,26.16)
IO12: length 31.7
  Top Layer w0.2: v1(50.48,8.95) 52.01,8.95 52.71,8.25 52.71,2.92 H14.16
  Top Layer w0.312: v1(41.02,24.64) 41.02,26.01 U41.14
  Bottom Layer w0.2: v1(41.02,24.64) 41.02,22.99 44.45,19.56 44.45,15.49 43.94,14.99 43.94,14.35 49.34,8.95 v1(50.48,8.95)
IO16: length 30.3
  Top Layer w0.2: v1(55.37,12.06) 55.37,2.79 H14.14
  Top Layer w0.312: 59,28.57 57.73,28.57 v1(57.22,28.06)
  Bottom Layer w0.2: v1(55.37,12.06) 54.61,12.83 54.61,23.24 57.22,25.85 v1(57.22,28.06)
IO35: length 42.4
  Top Layer w0.2: H14.13 56.51,7.11
  Top Layer w0.312: U41.7 42.29,34.92 v1(48.9,28.32)
  Bottom Layer w0.312: v1(48.9,28.32) 53.21,28.32 54.48,27.05 54.48,25.65 52.07,23.24 52.07,12.57 53.97,10.67 53.97,9.65 56.51,7.11
LED_B: length 96.3
  Top Layer w0.2: v1(85.09,38.36) 85.85,38.36 R14.1 ; 42.93,27.3 46.36,27.3 47.62,26.03 53.59,26.03 54.99,27.43 v1(55.37,27.43) ; 42.93,27.3 v1(42.93,23.75) ; 42.93,27.3 U41.13 ; v1(44.83,14.61) 44.7,14.61 44.45,14.86 v1(44.45,20.83) ; v1(70.61,41.02) 70.23,41.4 62.61,41.4 61.59,40.39 61.59,35.94 61.21,35.56 61.21,31.37 60.96,31.11 v1(60.58,31.11) ; v1(54.74,10.16) 54.36,9.78 v1(51.31,9.78) ; v1(56.26,10.16) 60.32,6.1 60.32,2.67 61.34,1.65 H14.10
  Bottom Layer w0.2: v1(51.31,9.78) 50.04,9.78 45.21,14.61 v1(44.83,14.61) ; v1(44.45,20.83) 42.93,22.35 v1(42.93,23.75) ; v1(60.58,31.11) 59.44,31.11 55.75,27.43 v1(55.37,27.43) ; 85.09,38.35 83.06,38.35 81.79,39.62 72.01,39.62 v1(70.61,41.02) ; v1(54.74,10.16) v1(56.26,10.16)
LED_G: length 75.9
  Top Layer w0.2: U41.23 54.44,26 55.12,26.67 56.26,26.67 56.9,26.03 v1(56.9,24.13) ; v1(84.2,37.35) R13.1 ; v1(60.58,30.48) 61.21,30.48 61.85,31.11 61.85,35.43 62.1,35.69 62.1,40.13 62.87,40.89 69.85,40.89 v1(70.1,40.64) ; H14.8 64.13,1.78 62.87,3.05 62.87,8.13 v1(58.17,12.83) 57.15,13.84 57.15,20.45 v1(56.01,21.59)
  Bottom Layer w0.2: v1(70.1,40.64) 71.63,39.12 81.53,39.12 83.3,37.35 v1(84.2,37.35) ; v1(60.58,30.48) 60.58,27.81 v1(56.9,24.13) 56.01,23.24 v1(56.01,21.59)
LED_R: length 89.2
  Top Layer w0.2: v1(45.09,20.45) v1(47.02,20.45) ; v1(50.42,10.54) 54.1,10.54 v1(54.61,11.05) ; v1(56.26,11.05) 57.02,11.05 61.59,6.48 H14.9 ; v1(71.12,41.53) 70.74,41.91 62.48,41.91 61.09,40.51 61.09,36.19 60.58,35.69 v1(60.58,31.75) ; v1(83.31,39.12) R12.1
  Top Layer w0.312: v1(45.56,26.67) U41.16
  Bottom Layer w0.2: v1(47.02,20.45) 47.02,13.94 v1(50.42,10.54) ; v1(71.12,41.53) 72.52,40.13 82.3,40.13 v1(83.31,39.12) ; v1(54.61,11.05) v1(56.26,11.05) ; v1(60.58,31.75) 59.56,31.75 56.13,28.32 54.1,28.32 53.47,28.96 47.84,28.96 v1(45.56,26.67) 45.56,23.84 45.09,23.37 v1(45.09,20.45)
MISO: length 46.6
  Top Layer w0.2: H14.21 45.82,4.19 44.55,2.92 43.18,2.92 38.99,7.11 38.61,7.11
  Top Layer w0.312: 38.61,7.11 41.78,10.29 43.42,10.29 48.26,15.12 H9.5 H10.5 ; v1(52.07,27.69) 52.07,28.83 56.77,33.53 58.88,33.53 U41.31
  Bottom Layer w0.312: 48.26,19.69 48.26,23.62 52.07,27.43 v1(52.07,27.69)
MOSI: length 60.7
  Top Layer w0.2: 36.07,7.11 38.35,4.83 38.35,3.3 38.74,2.92 42.16,2.92 42.54,2.54 42.54,0.89 43.03,0.4 45.1,0.4 H14.22
  Top Layer w0.312: H10.6 H9.6 45.72,14.35 43.56,12.19 41.15,12.19 36.07,7.11 ; v1(50.42,27.69) 50.42,29.21 55.88,34.67 55.88,39.5 57.66,41.28 59,41.28 59,41.27
  Bottom Layer w0.312: 45.72,19.69 45.72,22.99 v1(50.42,27.69)
RELAY: length 61.7
  Top Layer w0.312: R20.1 66.94,27.44 66.68,27.18 62.48,27.18 61.98,27.69 61.98,29.08 v1(61.34,29.72) ; U41.10 v1(43.92,31.11)
  Bottom Layer w0.2: H14.12 57.78,2.92 57.78,8.38 57.15,9.02 57.15,23.24 61.34,27.43 v1(61.34,29.72)
  Bottom Layer w0.312: v1(61.34,29.72) 61.34,31.88 60.58,32.64 59.14,32.64 57.61,31.11 v1(43.92,31.11)
RFID0_SS: length 40.6
  Top Layer w0.312: 40.64,16.51 40.39,16.51 ; 40.26,16.38 37.59,19.05 37.59,32.13 39.11,33.65 U41.8
  Bottom Layer w0.2: H9.8 40.64,14.73 44.96,10.41 44.96,3.68 45.72,2.92 48.51,2.92 48.9,3.3 48.9,4.19
RFID1_SS: length 37.9
  Top Layer w0.312: U41.9 39.5,32.38 38.86,31.75 38.86,20.83 H10.8
  Bottom Layer w0.2: H10.8 41.91,17.78 41.91,15.75 49.15,8.51 49.78,8.51 50.16,8.13 50.16,5.97 50.42,5.72 52.58,5.72 53.97,4.32 H14.15
RFID_RST: length 41.4
  Top Layer w0.2: H14.17 51.44,4.7 50.16,5.97 50.16,8.13 49.78,8.51 49.78,11.3 51.59,13.11 52.99,13.11 H9.2
  Top Layer w0.312: v1(44.32,21.84) 53.72,21.84 55.88,19.69 ; 41,28.57 v1(44.32,28.57) ; H10.2 H9.2
  Bottom Layer w0.312: v1(44.32,21.84) 44.32,21.85 v1(44.32,28.57)
RTS: length 22.5
  Top Layer w0.2: U37.19 v1(26.65,15.72) ; H13.1 32.26,2.92 30.23,2.92 28.96,4.19 v1(27.31,4.19) 26.42,4.19 26.03,3.81 Q1.2 Q1.3
  Bottom Layer w0.2: v1(26.65,15.72) 27.31,15.06 v1(27.31,4.19)
RX: length 66.5
  Top Layer w0.2: v1(25.71,20.07) 26.61,19.17 R5.2
  Top Layer w0.312: U41.35 58.79,38.73 58.53,38.48 v1(57.48,38.48)
  Bottom Layer w0.2: v1(57.48,38.48) 57.22,38.23 37.59,38.23 36.45,37.08 36.45,34.22 25.71,23.48 v1(25.71,20.07) ; 25.71,20.06 25.61,19.96 25.61,18.83 26.48,17.97 27.08,17.97 27.47,17.57 27.47,16.91 28.47,15.91 28.47,7.66 30.66,5.46 31.62,5.46 32.89,4.19 H13.3
SCK: length 93.6
  Top Layer w0.2: U41.30 57.4,32.38 v1(57.15,32.13) ; H11.6 34.04,6.98 35.69,5.33 35.69,3.68 36.45,2.92 37.72,2.92 38.35,2.29 38.35,1.27 39.12,0.51 41.02,0.51 41.91,1.4 v1(41.91,2.29) ; v1(45.09,2.41) 45.59,2.92 47.12,2.92 47.62,2.41 47.62,1.02 48.24,0.4 65.04,0.4 66.29,1.65 H14.6 ; v1(38.23,28.19) v1(38.23,31.24)
  Top Layer w0.312: 33.53,7.11 40,13.59 40.77,13.59 H9.7 H10.7
  Bottom Layer w0.2: H10.7 38.23,24 v1(38.23,28.19) ; v1(38.23,31.24) 39.12,32.13 v1(57.15,32.13) ; v1(41.91,2.29) 42.54,2.92 44.58,2.92 v1(45.09,2.41)
SCL: length 45.7
  Top Layer w0.312: R21.2 H7.4 H6.4 ; v1(60.52,38.1) 60.52,39.81 60.2,40.13 59.13,40.13 U41.36
  Bottom Layer w0.2: H6.4 65.53,18.54 65.53,5.33 H14.5
  Bottom Layer w0.312: v1(60.52,38.1) 63.88,34.74 H7.4
SDA: length 48.1
  Top Layer w0.312: 59,36.19 60.14,36.19 v1(60.52,36.57) ; R22.2 67.94,22.74 69.09,21.59 69.09,18.54 68.07,17.53 H6.3 H7.3
  Bottom Layer w0.2: H14.7 62.48,5.84 62.48,16.13 H7.3
  Bottom Layer w0.312: H7.3 63.5,17.53 61.98,19.05 61.98,35.12 v1(60.52,36.57)
SW: length 69.3
  Top Layer w0.2: SW1.3 89.34,26.03 v1(61.21,26.03) 61.21,28.83 60.2,29.84 U41.28
  Top Layer w0.312: 94.68,23.88 R8.1 92.96,25.93 92.94,25.94 ; SW1.3 92.94,25.94 ; 92.94,25.94 SW1.4
  Bottom Layer w0.2: H14.11 59.69,4.83 59.69,24.51 v1(61.21,26.03)
TX: length 66.7
  Top Layer w0.2: R4.2 v1(25.15,20.19) 25.53,20.57 v1(26.23,20.57)
  Top Layer w0.312: v1(57.48,37.72) 58.53,37.72 58.79,37.46 U41.34
  Bottom Layer w0.2: H13.4 29.57,4.19 29.24,4.52 29.24,4.89 29.75,5.4 29.75,5.69 29.32,6.11 28.36,6.11 28.07,6.41 28.07,15.75 25.15,18.67 v1(25.15,20.19) ; v1(57.48,37.72) 57.37,37.83 56.93,37.83 56.68,37.57 56.34,37.57 56.11,37.8 55.73,37.8 55.52,37.59 55.2,37.59 55,37.79 54.61,37.79 54.41,37.59 54.1,37.59 53.9,37.79 53.71,37.79 53.5,37.58 53.24,37.58 53,37.83 37.76,37.83 36.85,36.92 36.85,34.06 26.16,23.37 26.16,20.65 v1(26.23,20.57)
USB5V: length 21.1
  Top Layer w0.312: D8.1 v1(23.62,5.21)
  Top Layer w0.5: D2.1 14.24,11.97 14.24,11.2 ; H16.4 14.22,11.18 14.24,11.2 ; 14.24,11.2 v1(14.24,8.34)
  Bottom Layer w0.312: v1(18.53,8.34) v1(19.04,8.34) 21.37,8.34 23.62,6.1 v1(23.62,5.21)
  Bottom Layer w0.44: v1(18.53,8.34) 17.23,8.34 16.76,7.87 16,7.87 15.53,8.34 v1(14.87,8.34) v1(14.24,8.34)
$1N379: length 8.2
  Top Layer w0.254: USB1.10 18.39,5.62 20.07,3.94 22.48,3.94 23.24,3.17 R1.1
$1N383: length 8.5
  Top Layer w0.254: R2.1 10.29,3.3 11.18,4.19 13.97,4.19 15.37,5.59 15.37,7.31 USB1.4
$1N1005: length 8.5
  Top Layer w0.2: U37.4 19.82,12.58 19.3,12.06 19.3,9.65 18.8,9.15 D1.4
$1N1016: length 8.5
  Top Layer w0.2: D1.6 17.78,10.16 18.54,10.16 18.8,10.41 18.8,12.19 19.68,13.08 20,13.08 20.35,13.42 20.67,13.42 21.01,13.09 21.32,13.09 21.68,13.44 21.99,13.44 22.35,13.08 U37.3
$1N2492: length 1.7
  Top Layer w0.312: LED白.2 76.33,41.42 R7.2
$1N3538: length 1.6
  Top Layer w0.312: LED蓝.1 80.56,39.78 R11.1
$1N6214: length 5.4
  Top Layer w0.2: U34.8 27.18,27.94 27,27.76 27,23.69 R15.1
$1N6447: length 6.3
  Top Layer w0.2: U36.2 25.53,21.08 25.02,21.59 R30.1
$1N8585: length 4.4
  Top Layer w0.2: U37.16 27.4,13.08 27.94,13.08 28.19,12.83 C6.2
$1N8799: length 3
  Top Layer w0.2: R4.1 25.65,17.16 U37.21
$1N8801: length 3
  Top Layer w0.2: U37.20 26.15,17.14 R5.1
$1N8937: length 2.1
  Top Layer w0.2: R17.2 26.01,9.39 25.15,10.25 U37.9
$1N9236: length 1.7
  Top Layer w0.312: 72.39,39.74 72.3,39.83 72.3,41.43
$1N9240: length 20.9
  Top Layer w0.312: D3.2 Q2.3 71.96,32.75 K1.2 ; v1(72.3,44.02) 72.3,43.13
  Bottom Layer w0.312: K1.2 68.96,36.2 68.96,40.68 v1(72.3,44.02)
$1N9454: length 3.6
  Top Layer w0.312: R19.1 R20.2 67,29.01 Q2.1
$1N9531: length 13.3
  Top Layer w0.5: U39.1 80.65,10.43 80.65,19.56 81.81,20.72 K1.4
  vias: v1(78.87,8.64) v1(78.87,7.11) v1(79.38,7.87) v1(79.88,8.64) v1(79.88,7.11) v1(80.39,7.87) v1(80.77,8.64) v1(80.77,7.11) v1(81.28,7.87) v1(81.66,8.64) v1(81.66,7.11)
$1N9535: length 28.1
  Bottom Layer w0.5: K1.1 78.23,17.02 79.63,15.62 81.41,15.62 84.2,12.83 U39.3
  vias: v1(82.83,8.64) v1(82.83,7.11) v1(83.34,7.87) v1(83.72,8.64) v1(83.72,7.11) v1(84.23,7.87) v1(84.61,8.64) v1(84.61,7.11) v1(85.12,7.87) v1(85.5,8.64) v1(85.5,7.11)
$1N9540: length 14.2
  Top Layer w0.5: 76.45,2.03 76.96,1.52 85.85,1.52 87.7,3.37 U39.6
  vias: v1(86.51,8.64) v1(86.51,7.11) v1(86.89,7.87) v1(87.27,8.64) v1(87.27,7.11) v1(87.65,7.87) v1(88.03,8.64) v1(88.03,7.11) v1(88.41,7.87) v1(88.79,8.64) v1(88.79,7.11)
$1N10830: length 1.7
  Top Layer w0.312: LED绿.2 78.49,41.32 R23.1
$1N11549: length 1.7
  Top Layer w0.312: LED红.1 R24.1
$1N13650: length 11.4
  Top Layer w0.5: 20.12,42.88 D5.1 20.95,38.91 L12.1 ; 20.12,42.88 20.17,42.93 C389.1 ; 20.12,42.88 20.12,44.78 20.07,44.83 U43.8
$1N13751: length 30.7
  Top Layer w0.312: v1(20.95,33.76) L12.2 ; v1(27.18,43.7) R34.1
  Top Layer w0.5: D7.2 22.42,24.78 C388.2 C387.2 25.13,29.21 C386.2 C385.2 24.94,31.99 L12.2
  Bottom Layer w0.312: v1(20.95,33.76) 20.95,37.47 v1(27.18,43.7)
$1N13789: length 3.6
  Top Layer w0.5: C389.2 24.77,42.93 25.86,44.02 U43.1
$1N38602: length 4.1
  Top Layer w0.2: LED1.3 86.84,40.61 R14.2
$1N38604: length 4.4
  Top Layer w0.2: LED1.1 83.84,41.16 R12.2
$1N38606: length 4.2
  Top Layer w0.2: LED1.2 85.34,40.89 R13.2
$1N38886: length 1.7
  Top Layer w0.312: C390.2 R36.1

## Copper pours and planes (outline as drawn; the poured copper is in the pictures)
3V3 on Top Layer: 36.07,46.36 36.83,46.36 36.83,44.96 36.07,44.96
3V3 on Top Layer: 94.71,14.61 96.12,14.61 96.12,13.22 94.71,13.22
3V3 on Top Layer: 29.25,34.29 30.84,34.29 30.84,32.8 29.25,32.8
3V3 on Top Layer: 32.89,46.48 33.78,46.48 33.78,44.96 32.89,44.96
3V3 on Bottom Layer: 32.89,46.48 33.78,46.48 33.78,44.96 32.89,44.96
3V3 on Bottom Layer: 94.71,14.61 96.12,14.61 96.12,13.22 94.71,13.22
3V3 on Bottom Layer: 29.93,34.29 31.12,34.29 31.12,32.77 29.93,32.77
3V3 on Bottom Layer: 36.07,46.36 36.83,46.36 36.83,44.96 36.07,44.96
+5V on Top Layer: 21.59,23.24 23.32,23.24 23.32,21.53 21.59,21.53
+5V on Top Layer: 65.53,40.64 66.93,40.64 66.93,38.73 65.53,38.73
+5V on Bottom Layer: 90.81,11.81 91.69,11.81 91.69,9.78 90.81,9.78
+5V on Bottom Layer: 31.88,33.4 33.02,33.4 33.02,32.26 31.88,32.26
+5V on Bottom Layer: 65.53,40.64 66.93,40.64 66.93,39.24 65.53,39.24
+5V on Bottom Layer: 21.55,23.25 23.36,23.25 23.36,22.07 21.55,22.07
GND on Top Layer: -20.57,69.09 146.56,69.09 146.56,-29.84 -20.57,-29.84
GND on Bottom Layer: -42.16,92.46 128.65,92.46 128.65,-23.62 -42.16,-23.62
VCC on Top Layer: 10.16,41.15 12.32,41.15 12.32,34.54 10.16,34.54
VCC on Top Layer: 10.16,45.5 12.28,45.5 12.28,41.15 10.16,41.15
VCC on Top Layer: 10.14,45.5 17.47,45.5 17.47,43.79 10.14,43.79
VCC on Top Layer: 3.94,35.31 12.32,35.31 12.32,32.39 3.94,32.39
VDD on Top Layer: 22.86,12.32 23.88,12.32 23.88,11.3 22.86,11.3
3.3_SENSOR on Top Layer: 60.39,13.4 60.39,15.56 61.91,15.56 61.91,13.4
3.3_SENSOR on Top Layer: 63.88,28.96 65.79,28.96 65.79,27.69 63.88,27.69
3.3_SENSOR on Top Layer: 65.02,24.77 66.29,24.77 66.29,23.75 65.02,23.75
3.3_SENSOR on Bottom Layer: 65.02,24.77 66.29,24.77 66.29,23.75 65.02,23.75
3.3_SENSOR on Bottom Layer: 64.8,28.96 65.79,28.96 65.79,27.7 64.8,27.7
USB5V on Top Layer: 13.59,12.57 14.61,12.57 14.61,10.92 13.59,10.92
USB5V on Top Layer: 13.92,8.75 14.53,8.75 14.53,6.76 13.92,6.76
USB5V on Top Layer: 18.74,8.67 19.34,8.67 19.34,6.76 18.74,6.76
USB5V on Bottom Layer: 13.84,8.76 15.24,8.76 15.24,8 13.84,8
$1N9531 on Top Layer: 78.61,23.37 86.11,23.37 86.11,18.42 78.61,18.42
$1N9531 on Top Layer: 78.61,23.37 82.04,23.37 82.04,11.43 78.61,11.43
$1N9531 on Top Layer: 78.61,12.45 82.04,12.45 82.04,3.81 78.61,3.81
$1N9531 on Bottom Layer: 78.61,11.94 82.04,11.94 82.04,3.81 78.61,3.81
$1N9535 on Top Layer: 82.42,11.94 85.85,11.94 85.85,3.81 82.42,3.81
$1N9535 on Bottom Layer: 82.42,14.61 85.85,14.61 85.85,3.81 82.42,3.81
$1N9535 on Bottom Layer: 76.07,37.21 80.52,37.21 80.52,13.86 76.07,13.86
$1N9535 on Bottom Layer: 76.07,17.78 85.85,17.78 85.85,13.46 76.07,13.46
$1N9540 on Top Layer: 86.23,11.94 89.06,11.94 89.06,2.97 86.23,2.97
$1N9540 on Top Layer: 73.79,23.37 78.23,23.37 78.23,-2.12 73.79,-2.12
$1N9540 on Top Layer: 70.23,23.37 77.22,23.37 77.22,18.03 70.23,18.03
$1N9540 on Top Layer: 75.18,3.43 89.06,3.43 89.06,-0.07 75.18,-0.07
$1N9540 on Bottom Layer: 86.23,11.94 89.15,11.94 89.15,3.81 86.23,3.81

Small or netless copper shapes (teardrops, artwork), in the pictures only: 456 on Top Layer, 164 on Bottom Layer

## Text on the board
Top Silkscreen Layer: GND | DP | ADC | DN | 5V | _INT | DTR | CAN | TX | SCK | RTS | RX | MOSI | IO0 | RFID0 | RFID1 | MISO | 3V3 | EN | _CS | CAN TX | CAN RX | SENSOR | IO2 | ID0 | INT | RF | RST | CS | RF1 | IO12 | SS | RFID | IO35 | IO16 | LAY | SW | RE | LED | B | R | SDA | G | SCL | RELA Y\N | 12V | CAN_H | CAN_L | ON | OFF | POWER | USB | RGBLED | 5V>3V3
